# EasyEDA Pro project STM32功能模块V2.epro, board STM32功能模块V2-5V-GND互换
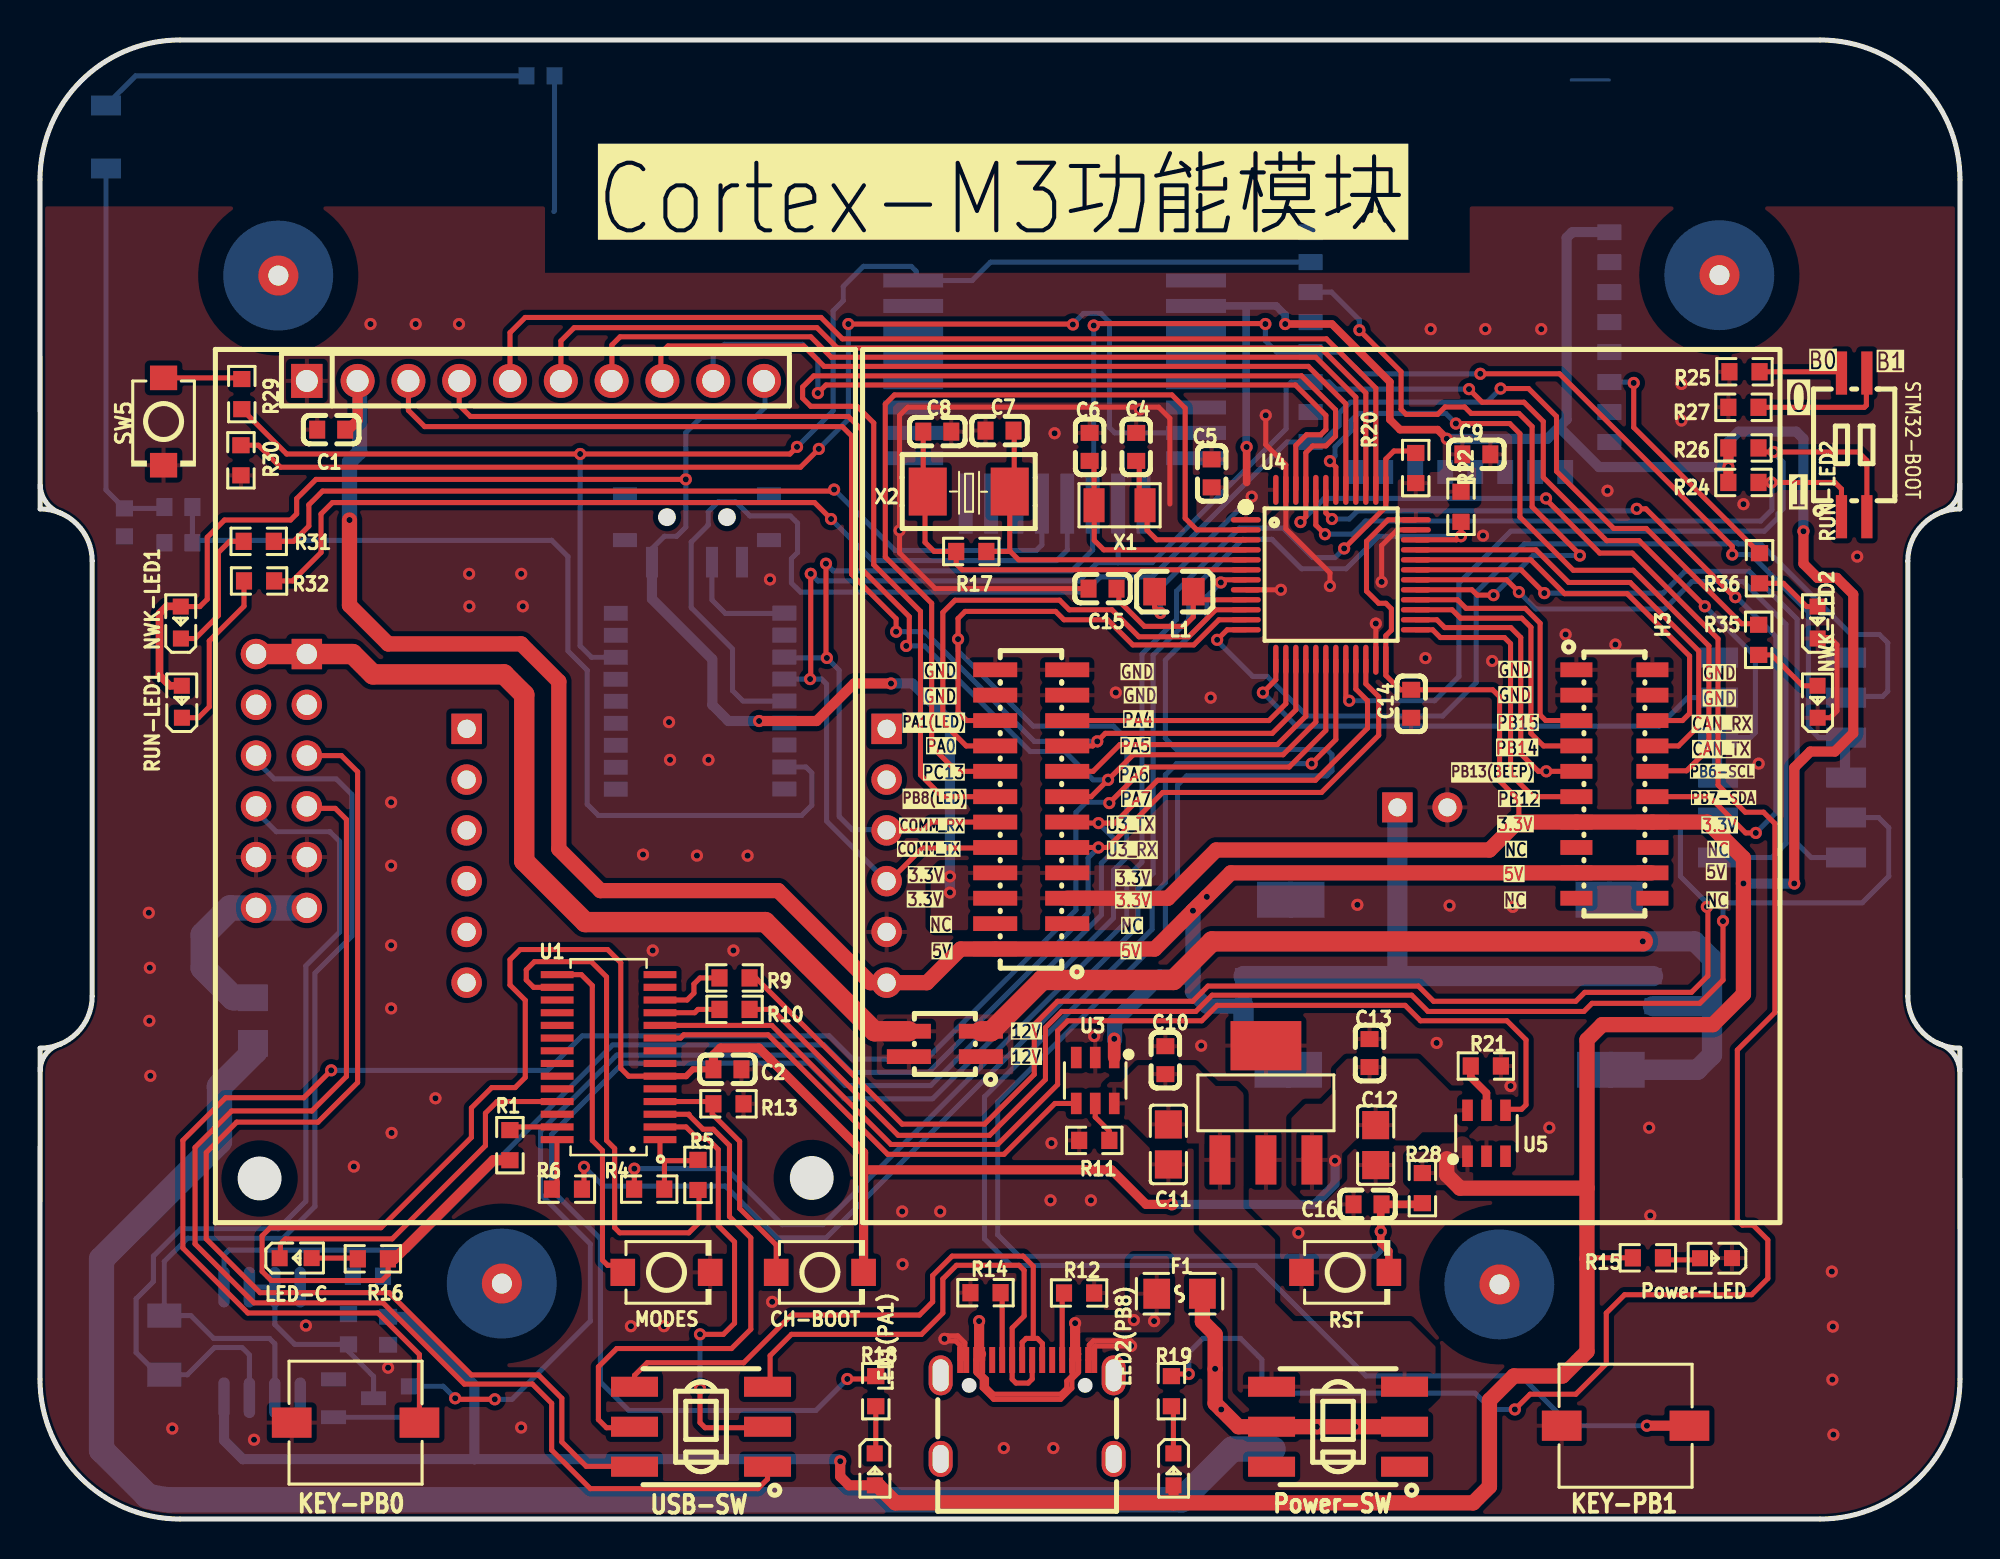
[diagram p1: board, top side]
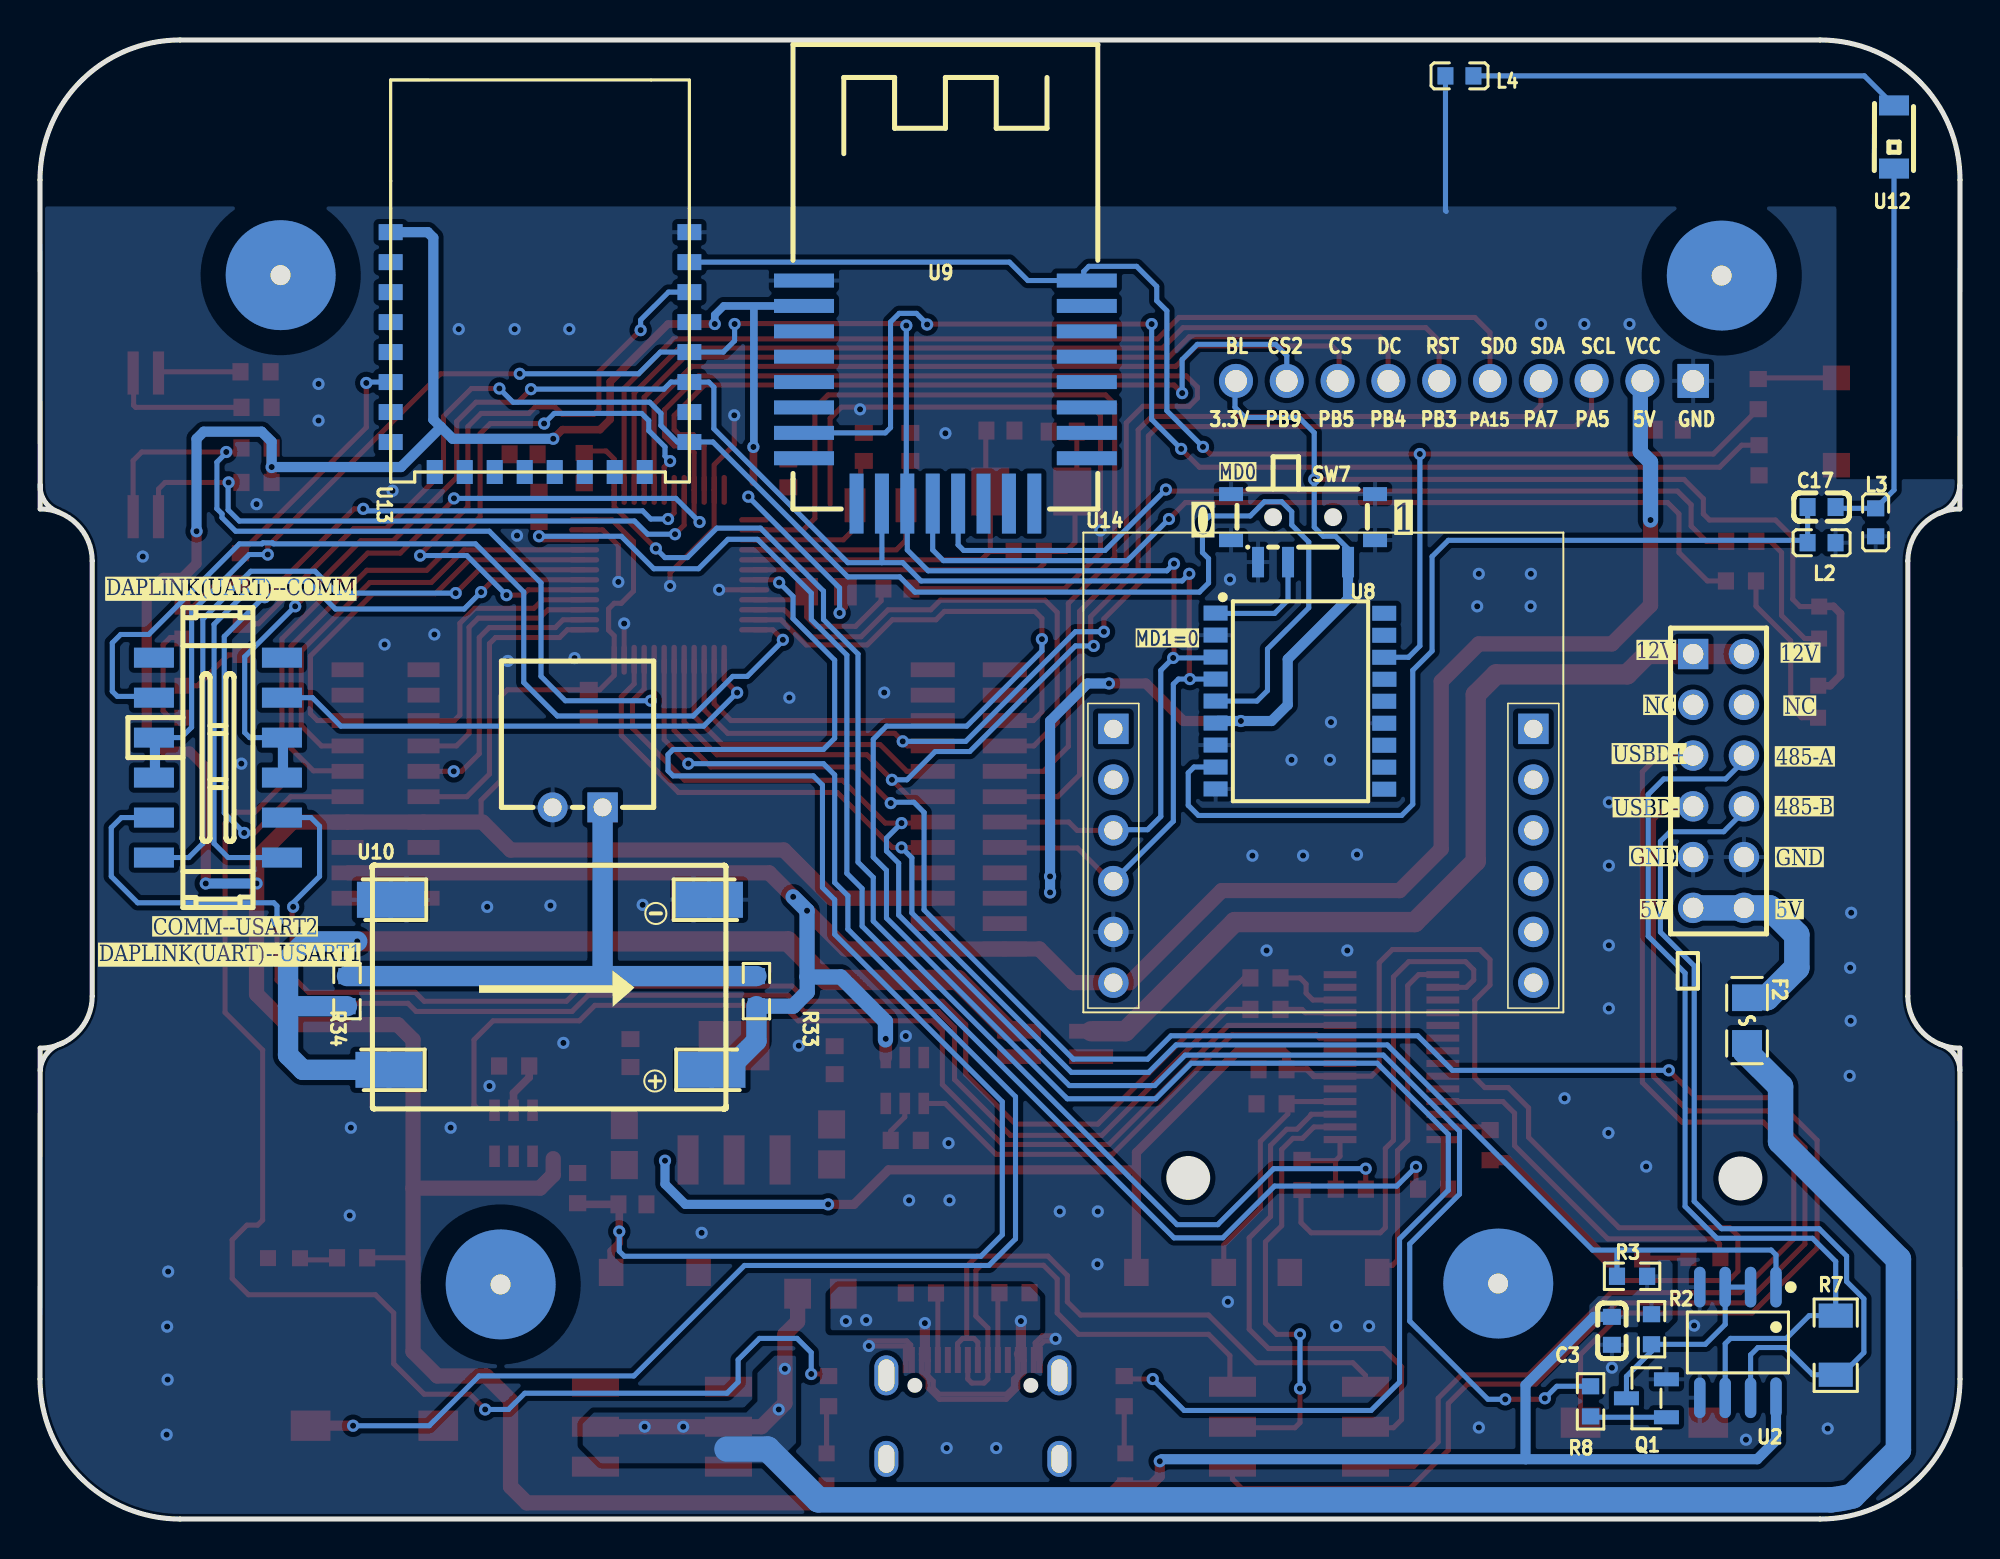
[diagram p2: board, bottom side, seen from below]

Outline 96 x 74 mm; copper layers: Top Layer, Bottom Layer. Coordinates in mm from the lower left corner of the outline.
Outline path: 0.01,22.44 arc(0.3,23.27) 1.03,23.76 ; 1.07,50.31 arc(0.32,50.85) 0.01,51.73 ; 94.87,23.81 arc(95.65,23.3) 95.99,22.44 ; 95.99,51.76 arc(95.76,50.92) 95.07,50.38 ; 0,67 0.01,50.54 arc(1.85,49.77) 2.61,47.94 2.61,26.16 arc(1.85,24.32) 0.01,23.56 0,7 arc(2.05,2.05) 7,0 89,0 arc(93.95,2.05) 96,7 95.99,23.56 arc(94.15,24.32) 93.39,26.16 93.39,47.94 arc(94.15,49.77) 95.99,50.54 96,67 arc(93.95,71.95) 89,74 7,74 arc(2.05,71.95) 0,67
Stack: Top Layer 0.035mm / Dielectric1 1.51mm FR4 er 4.5 / Bottom Layer 0.035mm

## Design rules (mm)
template: JLCPCB Capability(Two Layers Board)
spacing copperThickness1oz (default): track to track 0.102, other pairs 0.152 to 0.3
spacing copperThickness2oz: track to track 0.203, other pairs 0.152 to 0.3
track width copperThickness1oz (default): min 0.127, default 0.254, max 2.54
track width copperThickness2oz: min 0.203, default 0.254, max 2.54
differential pair differentialPair (default): width min 0.127, default 0.254, max 2.54; gap min 0.152, default 0.152
via viaSize (default): diameter min 0.5, default 0.61, max 10; hole min 0.3, default 0.305, max 6.3

## Placement (name value [footprint] x y rotation side)
C1  100nF  [C0603]  14.56 54.5 0 top
C2  100nF  [C0603]  34.37 22.5 180 top
C3  100nF  [C0603]  17.41 9.42 90 bottom
C4  12pF  [C0603]  54.81 53.64 270 top
C5  100nF  [C0603]  58.58 52.31 90 top
C6  12pF  [C0603]  52.48 53.64 270 top
C7  20pF  [C0603]  47.98 54.46 180 top
C8  20pF  [C0603]  44.86 54.41 0 top
C9  100nF  [C0603]  71.82 53.27 0 top
C10  100nF  [C0603]  56.27 22.96 270 top
C11  10uF  [C0805]  56.42 18.74 90 top
C12  10uF  [C0805]  66.78 18.71 90 top
C13  100nF  [C0603]  66.48 23.31 270 top
C14  100nF  [C0603]  68.56 40.79 90 top
C15  100nF  [C0603]  53.13 46.55 0 top
C16  100nF  [C0603]  66.38 15.74 0 top
C17  5pF  [C0603]  6.92 50.63 180 bottom
CH-BOOT  TS-1088-AR02016  [SW-SMD_L3.9-W3.0-P4.45]  38.99 12.34 0 top
CN1  ZX-XH2.54-2PWZ  [CONN-TH_2P-P2.50_ZX-XH2.54-2PWZ]  69.12 35.61 0 bottom
DIP1  -  [贴片铜柱M3*6+1]  11.92 61.96 180 bottom
DIP2  -  [贴片铜柱M3*6+1]  23.09 11.53 180 bottom
DIP3  -  [贴片铜柱M3*6+1]  83.97 61.98 180 bottom
DIP4  -  [贴片铜柱M3*6+1]  72.97 11.48 180 bottom
F1  SMD0805B100TF  [F0805]  56.98 11.27 0 top
F2  SMD0805B100TF  [F0805]  10.65 24.94 270 bottom
H1  HX PZ2.54-2x6P ZZ  [HDR-TH_12P-P2.54-V-M-R2-C6-S2.54_77313-101-12LF]  12.07 36.93 270 bottom
H2  X1321FVS-2x02-C43D48  [HDR-SMD_4P-P1.27-V-F-R2-C2-LS4.8]  45.24 23.77 90 top
H3  X1321FVS-2x10-C43D48  [HDR-SMD_20P-P1.27-V-F-R2-C10-LS4.8]  78.72 36.77 270 top
K1  TS665WS  [SW-SMD_L6.0-W6.0-LS6.6]  15.78 4.82 0 top
K2  TS665WS  [SW-SMD_L6.0-W6.0-LS6.6]  79.28 4.67 0 top
K3  5.1kΩ  [SW-TH_K3-2268S-F1]  87.1 38.1 180 bottom
L1  100uH  [L0805]  56.7 46.4 180 top
L2  39nH  [L0603]  6.92 48.85 0 bottom
L3  39nH  [L0603]  4.22 49.87 90 bottom
L4  68nH  [L0603]  25.03 72.2 180 bottom
LCD1  -  [1.54寸带字库液晶屏]  24.77 45.56 0 top
LED1(PA1)  XL-1608UBC-04  [LED0603-RD_BLUE]  41.74 2.48 270 top
LED2(PB8)  XL-1608UBC-04  [LED0603-RD_BLUE]  56.67 2.48 270 top
LED-C  XL-1608SURC-06  [LED0603-RD_BLUE]  12.78 13.05 0 top
MODES  TS-1088-AR02016  [SW-SMD_L3.9-W3.0-P4.45]  31.32 12.34 0 top
NWK-LED1  XL-1608UBC-04  [LED0603-RD_BLUE]  7.04 44.85 90 top
NWK-LED2  XL-1608UBC-04  [LED0603-RD_BLUE]  88.88 40.89 90 top
Power-LED  XL-1608SURC-06  [LED0603-RD_BLUE]  83.8 13.05 180 top
Q1  S8050  [SOT-23-3_L2.9-W1.3-P1.90-LS2.4-BR]  15.68 6.04 180 bottom
R1  1kΩ  [R0603]  23.5 18.7 90 top
R2  4.7kΩ  [R0603]  15.42 9.49 90 bottom
R3  4.7kΩ  [R0603]  16.4 12.14 0 bottom
R4  100Ω  [R0603]  30.46 16.51 180 top
R5  0Ω  [R0603]  32.9 17.22 90 top
R6  100Ω  [R0603]  26.35 16.51 0 top
R7  120Ω  [R1206]  6.21 8.7 270 bottom
R8  4.7kΩ  [R0603]  18.47 5.89 90 bottom
R9  270Ω  [R0603]  34.73 27.07 0 top
R10  270Ω  [R0603]  34.73 25.5 0 top
R11  150kΩ  [R0603]  52.71 18.94 0 top
R12  5.1kΩ  [R0603]  51.95 11.31 180 top
R13  1kΩ  [R0603]  34.42 20.77 180 top
R14  5.1kΩ  [R0603]  47.27 11.32 180 top
R15  1kΩ  [R0603]  80.39 13.07 180 top
R16  1kΩ  [R0603]  16.64 13.02 0 top
R17  1MΩ  [R0603]  46.56 48.41 0 top
R18  1kΩ  [R0603]  41.79 6.4 270 top
R19  1kΩ  [R0603]  56.57 6.4 270 top
R20  10kΩ  [R0603]  68.79 52.58 270 top
R21  300kΩ  [R0603]  72.29 22.66 180 top
R22  10kΩ  [R0603]  71.05 50.64 90 top
R24  100kΩ  [R0603]  85.17 51.86 0 top
R25  10kΩ  [R0603]  85.22 57.4 180 top
R26  100kΩ  [R0603]  85.17 53.59 0 top
R27  10kΩ  [R0603]  85.17 55.62 180 top
R28  10kΩ  [R0603]  69.12 16.56 90 top
R29  10kΩ  [R0603]  10.09 56.28 90 top
R30  0Ω  [R0603]  10.05 52.97 90 top
R31  1kΩ  [R0603]  10.94 48.92 180 top
R32  1kΩ  [R0603]  10.95 46.93 180 top
R33  0Ω  [R0603]  60.18 26.41 90 bottom
R34  0Ω  [R0603]  80.65 26.41 90 bottom
R35  1kΩ  [R0603]  85.93 43.99 270 top
R36  1kΩ  [R0603]  85.98 47.57 270 top
RST  TS-1088-AR02016  [SW-SMD_L3.9-W3.0-P4.45]  65.26 12.34 0 top
RUN-LED1  XL-1608UBC-04  [LED0603-RD_BLUE]  7.09 40.89 90 top
RUN-LED2  XL-1608UBC-04  [LED0603-RD_BLUE]  88.88 44.85 90 top
SW3  YTSPS-22E58LM  [SW-SMD_6P-L5.8-W5.8-P2.00-LS8.0_YTSPS-22E58LM]  64.9 4.62 180 top
SW4  YTSPS-22E58LM  [SW-SMD_6P-L5.8-W5.8-P2.00-LS8.0_YTSPS-22E58LM]  33.05 4.62 180 top
SW5  TS-1088-AR02016  [SW-SMD_L3.9-W3.0-P4.45]  6.18 54.91 270 top
SW7  MSK12C02-HB  [SW-TH_MSK12C02-HB-1]  32.85 49.58 0 bottom
U1  CH32V203G8R6  [QSOP-28_L9.9-W3.9-P0.64-LS6.0-BL]  28.43 23.11 90 top
U2  SP485EN  [SOP-8_L5.0-W4.0-P1.27-LS6.0-BL]  11.11 8.83 0 bottom
U3  CH217K  [SOT-23-6_L2.9-W1.6-P0.95-LS2.8-BL]  52.76 21.94 180 top
U4  STM32F103C8T6  [LQFP-48_L7.0-W7.0-P0.50-LS9.0-BL]  64.54 47.24 270 top
U5  CH217K  [SOT-23-6_L2.9-W1.6-P0.95-LS2.8-BL]  72.32 19.3 0 top
U6  AIC1221-33GY3TR  [SOT-223_L6.5-W3.5-P2.30-LS7.0-BR]  61.3 20.82 270 top
U7  ZX-1.27BM-2PSMD  [SW-SMD_2P-L5.4-W4.1-P1.27-LS8.4]  90.71 53.74 0 top
U8  -  [Lora小模块]  32.54 41.04 270 bottom
U9  E18-MS1-PCB  [WIRELM-SMD_E18-MS1-PCB]  50.73 56.38 90 bottom
U10  -  [DC-DCmini]  70.03 26.92 180 bottom
U11  X1321FVS-2x12-C43D48  [HDR-SMD_24P-P1.27-V-F-R2-C12-LS4.8]  49.56 35.5 90 top
U12  ANT3216LL00R2400A  [ANT-SMD_L3.2-W1.6]  3.3 69.14 90 bottom
U13  -  [JDY-25M蓝牙模块]  71.1 60.29 90 bottom
U14  -  [度云4G模块]  31.78 37.64 180 bottom
USBC1  TYPE-C-31-M-12  [USB-C_SMD-TYPE-C-31-M-12]  49.36 5.48 0 top
X1  32.768kHz  [CRYSTAL-SMD_L3.2-W1.5-1]  53.98 50.72 0 top
X2  8MHz  [CRYSTAL-SMD_L5.0-W3.2]  46.44 51.41 0 top

## Footprints (pads in the part's own frame, mm; a bottom-side part is the same pattern mirrored in y, then rotated)
1.54寸带字库液晶屏
  rect 1.575x1.7 hole 1.1: 1(-11.43,11.379)
  round 1.7 hole 1.1: 2(-8.89,11.379) 3(-6.35,11.379) 4(-3.81,11.379) 5(-1.27,11.379) 6(1.27,11.379) 7(3.81,11.379) 8(6.35,11.379) 9(8.89,11.379) 10(11.43,11.379)
ANT-SMD_L3.2-W1.6
  rect 1x1.5 smd: 1(-1.578,0) 2(1.578,0)
C0603
  rect 0.8x0.9 smd: 1(-0.7,0) 2(0.7,0)
C0805
  rect 1.41x1.35 smd: 1(-1,0) 2(1,0)
CONN-TH_2P-P2.50_ZX-XH2.54-2PWZ
  rect 1.524x1.5 hole 0.9: 1(-1.25,0)
  round 1.5 hole 0.9: 2(1.25,0)
CRYSTAL-SMD_L3.2-W1.5-1
  rect 1.05x1.7 smd: 1(-1.275,0) 2(1.275,0)
CRYSTAL-SMD_L5.0-W3.2
  rect 1.9x2.4 smd: 1(-2.05,0) 2(2.05,0)
DC-DCmini
  rect 1.8x1.8 smd: 1(-9.296,-4.445) 1(-7.721,-4.445) 2(-9.22,4.064) 2(-7.646,4.064) 3(6.832,-4.445) 3(8.408,-4.445) 4(6.705,4.064) 4(8.28,4.064)
F0805
  rect 1.335x1.5 smd: 1(-1.143,0) 2(1.143,0)
HDR-SMD_4P-P1.27-V-F-R2-C2-LS4.8
  rect 0.74x2.2 smd: 1(-0.635,-1.8) 2(-0.635,1.8) 3(0.635,-1.8) 4(0.635,1.8)
HDR-SMD_20P-P1.27-V-F-R2-C10-LS4.8
  rect 0.74x1.6 smd: 1(-5.715,-1.9) 2(-5.715,1.9) 3(-4.445,-1.9) 4(-4.445,1.9) 5(-3.175,-1.9) 6(-3.175,1.9) 7(-1.905,-1.9) 8(-1.905,1.9) 9(-0.635,-1.9) 10(-0.635,1.9) 11(0.635,-1.9) 12(0.635,1.9) 13(1.905,-1.9) 14(1.905,1.9) 15(3.175,-1.9) 16(3.175,1.9) 17(4.445,-1.9) 18(4.445,1.9) 19(5.715,-1.9) 20(5.715,1.9)
HDR-SMD_24P-P1.27-V-F-R2-C12-LS4.8
  rect 0.74x2.2 smd: 1(-6.985,-1.8) 2(-6.985,1.8) 3(-5.715,-1.8) 4(-5.715,1.8) 5(-4.445,-1.8) 6(-4.445,1.8) 7(-3.175,-1.8) 8(-3.175,1.8) 9(-1.905,-1.8) 10(-1.905,1.8) 11(-0.635,-1.8) 12(-0.635,1.8) 13(0.635,-1.8) 14(0.635,1.8) 15(1.905,-1.8) 16(1.905,1.8) 17(3.175,-1.8) 18(3.175,1.8) 19(4.445,-1.8) 20(4.445,1.8) 21(5.715,-1.8) 22(5.715,1.8) 23(6.985,-1.8) 24(6.985,1.8)
HDR-TH_12P-P2.54-V-M-R2-C6-S2.54_77313-101-12LF
  rect 1.52x1.52 hole 1.02: 1(-6.35,-1.27)
  round 1.52 hole 1.02: 2(-6.35,1.27) 3(-3.81,-1.27) 4(-3.81,1.27) 5(-1.27,-1.27) 6(-1.27,1.27) 7(1.27,-1.27) 8(1.27,1.27) 9(3.81,-1.27) 10(3.81,1.27) 11(6.35,-1.27) 12(6.35,1.27)
JDY-25M蓝牙模块
  rect 0.8x1.2 smd: 1(4.09,7.366) 2(2.59,7.366) 3(1.089,7.366) 4(-0.41,7.366) 5(-1.911,7.366) 6(-3.41,7.366) 7(-4.91,7.366) 8(-6.41,7.366) 17(-6.41,-7.569) 18(-4.91,-7.569) 19(-3.41,-7.569) 20(-1.911,-7.569) 21(-0.41,-7.569) 22(1.089,-7.569) 23(2.59,-7.569) 24(4.09,-7.569)
  rect 1.2x0.8 smd: 9(-7.91,5.164) 10(-7.91,3.664) 11(-7.91,2.164) 12(-7.91,0.664) 13(-7.91,-0.836) 14(-7.91,-2.336) 15(-7.91,-3.836) 16(-7.91,-5.336)
L0603
  rect 0.8x0.864 smd: 1(-0.7,0) 2(0.7,0)
L0805
  rect 1.133x1.377 smd: 1(-0.966,0) 2(0.966,0)
LED0603-RD_BLUE
  rect 0.8x0.8 smd: 1(-0.799,-0.004) 2(0.799,0.004)
Lora小模块
  rect 0.75x1.2 smd: 1(-4.283,-4.676) 2(-3.183,-4.676) 3(-2.083,-4.676) 4(-0.983,-4.676) 5(0.117,-4.676) 6(1.217,-4.676) 7(2.317,-4.676) 8(3.417,-4.676) 9(4.517,-4.676) 10(4.527,3.753) 11(3.427,3.753) 12(2.327,3.753) 13(1.227,3.753) 14(0.127,3.753) 15(-0.973,3.764) 16(-2.073,3.753) 17(-3.173,3.753) 18(-4.273,3.753)
LQFP-48_L7.0-W7.0-P0.50-LS9.0-BL
  oval 0.27x1.5 smd: 1(-2.75,-4.25) 2(-2.25,-4.25) 3(-1.75,-4.25) 4(-1.25,-4.25) 5(-0.75,-4.25) 6(-0.25,-4.25) 7(0.25,-4.25) 8(0.75,-4.25) 9(1.25,-4.25) 10(1.75,-4.25) 11(2.25,-4.25) 12(2.75,-4.25) 25(2.75,4.25) 26(2.25,4.25) 27(1.75,4.25) 28(1.25,4.25) 29(0.75,4.25) 30(0.25,4.25) 31(-0.25,4.25) 32(-0.75,4.25) 33(-1.25,4.25) 34(-1.75,4.25) 35(-2.25,4.25) 36(-2.75,4.25)
  oval 1.5x0.27 smd: 13(4.25,-2.75) 14(4.25,-2.25) 15(4.25,-1.75) 16(4.25,-1.25) 17(4.25,-0.75) 18(4.25,-0.25) 19(4.25,0.25) 20(4.25,0.75) 21(4.25,1.25) 22(4.25,1.75) 23(4.25,2.25) 24(4.25,2.75) 37(-4.25,2.75) 38(-4.25,2.25) 39(-4.25,1.75) 40(-4.25,1.25) 41(-4.25,0.75) 42(-4.25,0.25) 43(-4.25,-0.25) 44(-4.25,-0.75) 45(-4.25,-1.25) 46(-4.25,-1.75) 47(-4.25,-2.25) 48(-4.25,-2.75)
QSOP-28_L9.9-W3.9-P0.64-LS6.0-BL
  rect 0.355x1.64 smd: 1(-4.128,-2.57) 2(-3.493,-2.57) 3(-2.857,-2.57) 4(-2.223,-2.57) 5(-1.587,-2.57) 6(-0.953,-2.57) 7(-0.318,-2.57) 8(0.318,-2.57) 9(0.953,-2.57) 10(1.587,-2.57) 11(2.223,-2.57) 12(2.857,-2.57) 13(3.493,-2.57) 14(4.128,-2.57) 15(4.128,2.57) 16(3.493,2.57) 17(2.857,2.57) 18(2.223,2.57) 19(1.587,2.57) 20(0.953,2.57) 21(0.318,2.57) 22(-0.318,2.57) 23(-0.953,2.57) 24(-1.587,2.57) 25(-2.223,2.57) 26(-2.857,2.57) 27(-3.493,2.57) 28(-4.128,2.57)
R0603
  rect 0.806x0.864 smd: 1(-0.753,0) 2(0.753,0)
R1206
  rect 1.208x1.701 smd: 1(-1.479,0) 2(1.479,0)
SOP-8_L5.0-W4.0-P1.27-LS6.0-BL
  oval 0.574x2.035 smd: 1(-1.905,-2.768) 2(-0.635,-2.768) 3(0.635,-2.768) 4(1.905,-2.768) 5(1.905,2.768) 6(0.635,2.768) 7(-0.635,2.768) 8(-1.905,2.768)
SOT-23-3_L2.9-W1.3-P1.90-LS2.4-BR
  rect 1.25x0.7 smd: 1(1,-0.95) 2(1,0.95) 3(-1,0)
SOT-23-6_L2.9-W1.6-P0.95-LS2.8-BL
  rect 0.532x1.072 smd: 1(-0.95,-1.149) 2(0,-1.149) 3(0.95,-1.149) 4(0.95,1.149) 5(0,1.149) 6(-0.95,1.149)
SOT-223_L6.5-W3.5-P2.30-LS7.0-BR
  rect 2.465x1.05 smd: 1(2.857,-2.3) 2(2.857,0) 3(2.857,2.3)
  rect 2.465x3.54 smd: 4(-2.857,0)
SW-SMD_2P-L5.4-W4.1-P1.27-LS8.4
  rect 0.56x2.158 smd: 1(-0.635,-3.594) 2(0.635,-3.594) 3(0.635,3.594) 4(-0.635,3.594)
SW-SMD_6P-L5.8-W5.8-P2.00-LS8.0_YTSPS-22E58LM
  rect 2.35x1 smd: 1(-3.325,2) 2(-3.325,0) 3(-3.325,-2) 4(3.325,2) 5(3.325,0) 6(3.325,-2)
SW-SMD_L3.9-W3.0-P4.45
  rect 1.23x1.36 smd: 1(-2.185,0) 2(2.185,0)
SW-SMD_L6.0-W6.0-LS6.6
  rect 1.985x1.512 smd: 1(-3.192,0) 2(3.192,0)
SW-TH_K3-2268S-F1
  rect 2x1 smd: 1(3.2,5) 2(3.2,3) 3(3.2,1) 4(3.2,-1) 5(3.2,-3) 6(3.2,-5) 7(-3.2,5) 8(-3.2,3) 9(-3.2,1) 10(-3.2,-1) 11(-3.2,-3) 12(-3.2,-5)
SW-TH_MSK12C02-HB-1
  rect 0.6x1.524 smd: 1(-2.25,1.7) 2(0.75,1.7) 3(2.25,1.7)
  rect 1.2x0.7 smd: 4(-3.6,-1.7) 4(-3.6,0.6) 4(3.6,-1.7) 4(3.6,0.6)
USB-C_SMD-TYPE-C-31-M-12
  oval 1.2x2 hole 0.8x1.6: 0(-4.325,1.706) 1(4.325,1.706)
  oval 1.2x1.8 hole 0.8x1.4: 2(4.325,-2.474) 3(-4.325,-2.474)
  rect 0.3x1.3 smd: A1(-3.35,2.474) A4(-2.55,2.474) A5(-1.25,2.474) A6(-0.25,2.474) A7(0.25,2.474) A8(1.25,2.474) A9(2.55,2.474) A12(3.35,2.474) B1(3.05,2.474) B4(2.25,2.474) B5(1.75,2.474) B6(0.75,2.474) B7(-0.75,2.474) B8(-1.75,2.474) B9(-2.25,2.474) B12(-3.05,2.474)
WIRELM-SMD_E18-MS1-PCB
  rect 0.7x3 smd: 1(5.58,7.07) 2(4.309,7.07) 3(3.039,7.07) 4(1.77,7.07) 5(0.499,7.07) 6(-0.77,7.07) 7(-2.041,7.07) 8(-3.311,7.07) 17(-3.311,-7.07) 18(-2.041,-7.07) 19(-0.77,-7.07) 20(0.499,-7.07) 21(1.77,-7.07) 22(3.039,-7.07) 23(4.309,-7.07) 24(5.58,-7.07)
  rect 3x0.7 smd: 9(-5.58,4.445) 10(-5.58,3.175) 11(-5.58,1.905) 12(-5.58,0.635) 13(-5.58,-0.635) 14(-5.58,-1.905) 15(-5.58,-3.175) 16(-5.58,-4.445)
度云4G模块
  rect 1.524x1.524 hole 0.914: 1(-10.551,1.897) 12(10.449,1.897)
  round 1.524 hole 0.914: 2(-10.551,-0.643) 3(-10.551,-3.183) 4(-10.551,-5.723) 5(-10.551,-8.264) 6(-10.551,-10.803) 7(10.449,-10.803) 8(10.449,-8.264) 9(10.449,-5.723) 10(10.449,-3.183) 11(10.449,-0.643)
贴片铜柱M3*6+1
  round 5.5 smd: 1(0.007,0.254)
  round 2 hole 1x0.9: 2(0,0.254)

## Nets
As in the schematic, except:
3.3V: C3.2 C5.1 C9.1 C14.2 H3.13 H3.14 L1.2 LCD1.10 LED1(PA1).2 LED2(PB8).2 NWK-LED1.2 R2.2 R3.1 R15.2 R20.2 R22.2 R24.1 R26.1 R28.2 RUN-LED1.2 SW7.1 U2.8 U4.1 U4.24 U4.36 U4.48 U5.1 U8.6 U9.2 U11.5 U11.6 U11.7 U11.8 U13.1
3.3VIN: C2.2 C12.2 C13.2 CH-BOOT.2 R1.1 R16.2 U1.6 U5.6 U6.3
GND: C1.1 C2.1 C3.1 C4.1 C5.2 C6.1 C7.2 C8.2 C9.2 C10.1 C11.1 C12.1 C13.1 C14.1 C15.1 C16.1 CN1.2 H1.9 H1.10 H3.1 H3.2 H3.3 H3.4 K1.1 K2.1 L2.1 L3.1 L4.1 LCD1.1 MODES.2 NWK-LED2.1 Power-LED.1 Q1.2 R11.1 R12.1 R13.1 R14.2 R21.1 R25.2 R27.2 R30.1 RST.1 RUN-LED2.1 SW5.2 SW7.3 SW7.4 U1.7 U2.4 U2.5 U3.2 U4.8 U4.23 U4.35 U4.47 U5.2 U6.2 U6.4 U8.2 U8.7 U8.9 U8.13 U9.1 U10.2 U10.4 U11.21 U11.22 U11.23 U11.24 U13.24 U14.5 USBC1.A1 USBC1.A12 USBC1.B1 USBC1.B12
CH_BOOT: CH-BOOT.1 R13.2 U1.4
LED_CON: LED-C.1 U1.25
MODES: MODES.1 U1.15
RST: C16.2 R28.1 RST.2 U4.7
$1N1427: Power-LED.2 R15.1
$1N1431: LED-C.2 R16.1
$1N9049: LED1(PA1).1 R18.2
$1N51325: LED2(PB8).1 R19.2

Pads without a net: DIP1 1 2; DIP2 1 2; DIP3 1 2; DIP4 1 2; H1 3 4; H3 15 16 19 20; K3 1 7; SW3 1 4; U1 5 8 13 14 17 18 19 20 21 22 23 24 26; U3 3; U5 3; U8 10 11 12 14 15 17 18; U9 3 4 5 6 8 9 14 15 16 17 18 19 20 21 22 23; U11 3 4; U13 2 3 4 5 7 8 9 10 11 12 13 14 15 16 18 21; U14 1 2 7 8 9 10 11 12; USBC1 0 1 2 3 A8 B8

## Via types
v1: diameter 0.61, hole 0.305, Top Layer to Bottom Layer, 180 vias

## Routing (per net, layer and track width the routed paths; a pad name or vN(x,y) marks a point on that pad's centre or on a via; arc(x,y) is an arc through that point)
3.3V: length 366.6
  Top Layer w0.254: U4.24 67.29,42.21 68.01,41.49 C14.2 72.64,41.49 72.98,41.14 72.98,36.93 73.95,35.96 73.95,35.1 ; U4.36 67.4,49.99 66.33,48.92 66.33,46.43 66.93,45.82 67.29,45.82 67.57,45.54 67.57,44.47 67.29,44.19 67.29,42.99 ; R15.2 77.39,13.07 77.35,13.03 ; NWK-LED1.2 7.99,45.65 8.36,46.02 8.36,49.12 9.23,49.98 12.53,49.98 12.83,50.29 12.83,51.05 13.8,52.01 v1(32.29,52.01) ; v1(56.02,45.33) 55.73,45.62 55.73,46.4
  Top Layer w0.381: NWK-LED1.2 7.02,45.66 6.33,45.66 5.97,45.31 5.97,42.21 6.5,41.69 RUN-LED1.2 ; v1(70.34,54.05) 69.88,54.5 68,54.5 67.49,55.01 67.49,56.89 64.6,59.79 v1(62.26,59.79) ; v1(60.33,53.64) 60.33,51.86
  Top Layer w0.508: v1(88.17,49.42) 88.17,47.79 88.88,47.09 89.84,47.09 90.66,46.26 90.66,39.32 89.74,38.4 88.52,38.4 87.71,37.59 v1(87.71,31.8) ; LED1(PA1).2 40.45,1.68 40.01,2.13 v1(40.01,2.89) ; R26.1 v1(84.42,52.63) R24.1 ; LED2(PB8).2 56.68,0.81 ; v1(35.95,39.93) 38.83,39.93 40.71,41.8 v1(42.55,41.8)
  Top Layer w0.762: 70.34,18.03 70.34,17.22 71,16.56 77.35,16.56 ; 51.36,31.06 56.39,31.06 58.81,33.47 72.47,33.47 73.87,34.87 H3.13 H3.14 83.37,34.87 85.17,33.07 v1(85.17,31.8) 85.17,26.26 83.65,24.73 78.11,24.73 77.35,23.97 77.35,16.56 ; LED1(PA1).2 41.89,1.68 42.77,0.81 71.66,0.81 72.47,1.62 72.47,5.94 73.69,7.16 76.13,7.16 77.35,8.38 77.35,13.03 77.35,16.56
  Bottom Layer w0.254: SW7.1 30.6,48.55 31.22,49.17 31.83,49.17 32.29,49.63 v1(32.29,52.01) 32.29,54.35 33.05,55.11 35.74,55.11 36.25,55.62 36.25,56.89 LCD1.10 ; v1(56.02,45.33) 56.02,46.59 v1(60.58,51.15)
  Bottom Layer w0.381: v1(62.26,59.79) 62.26,60.24 61.81,60.69 U9.2 ; v1(60.33,53.64) 60.31,53.66 60.31,60.52
  Bottom Layer w0.508: SW7.1 30.6,46.03 33.61,43.02 33.61,40.73 34.42,39.93 v1(35.95,39.93) 37.12,39.93 U8.6 ; 21.72,2.99 39.91,2.99 v1(40.01,2.89) ; 21.72,2.99 10.14,2.99 9.2,3.93 U2.8 ; 21.72,2.99 21.72,6.7 18.31,10.12 17.41,10.12 ; U13.1 76.61,64.38 76.33,64.1 76.33,55.01 75.96,54.64 ; 75.96,54.64 75.96,54.62 77.95,52.63 v1(84.42,52.63) 84.42,53.9 84.92,54.4 87.81,54.4 88.17,54.04 v1(88.17,49.42) ; 75.96,54.64 75.37,54.05 v1(70.34,54.05) ; v1(45.5,31.35) v1(45.5,32.15) 45.5,39.92 43.62,41.8 v1(42.55,41.8) ; v1(85.17,31.8) 85.17,31.8 v1(87.71,31.8)
3.3VIN: length 99
  Top Layer w0.254: 17.4,12.97 17.41,12.96 17.41,12.24 17.1,11.93 11.56,11.93 11.11,12.39 11.11,14.17 11.51,14.57 17.05,14.57 21.57,19.1 21.57,20.57 22.59,21.59 23.75,21.59 24.26,22.09 24.26,25.95 23.5,26.72 23.5,27.99 24.01,28.49 28.38,28.49 29.04,27.83 29.04,22.55 29.43,22.16 U1.6
  Top Layer w0.305: U1.6 32.3,22.16 32.64,22.5 C2.2
  Top Layer w0.457: C2.2 33.67,23.21 34.03,23.57 35.95,23.57 41.18,18.33 41.18,17.47 ; 41.18,17.47 41.18,12.75 ; 41.18,17.47 53.57,17.47 55.3,15.74 v1(56.59,15.74)
  Top Layer w0.508: R1.1 22.66,17.95 17.71,13 17.4,13
  Bottom Layer w0.457: v1(64.75,17.93) 64.75,16.76 63.73,15.74 v1(56.59,15.74)
5V: length 112.8
  Top Layer w0.508: 15.26,54.35 15.88,54.97 LCD1.2
  Top Layer w0.635: U3.1 v1(53.71,24.02)
  Top Layer w0.762: v1(15.47,49.98) 15.47,45.72 17.41,43.78 24.06,43.78 25.94,41.91 25.94,33.52 28.02,31.44 36.91,31.44 41.52,26.83 U14.6 44.35,26.83 46.03,28.52 U11.2 55.73,28.52 v1(57.65,30.43) v1(58.34,31.13) 59.54,32.33 H3.17 80.57,32.33
  Bottom Layer w0.762: 57.64,27.12 55.96,27.12 53.73,24.89 53.73,23.97 ; 57.64,27.12 57.64,26.36 58.34,25.66 R33.1 ; 57.64,27.12 57.65,27.13 v1(57.65,30.43) v1(58.34,31.13) ; LCD1.2 15.98,56.84 15.98,53.39 15.47,52.88 v1(15.47,49.98)
  Bottom Layer w1.016: R33.1 60.18,23.92 U10.3
12V: length 96.7
  Top Layer w1.016: 10.55,43.28 15.63,43.28 16.64,42.26 23.2,42.26 24.21,41.24 24.21,32.91 27.26,29.87 36.27,29.87 41.73,24.4 H2.4 ; H2.3 47.55,24.4 50.12,26.97 56.67,26.97 58.6,28.9 v1(80.14,28.9)
  Bottom Layer w1.016: v1(80.14,28.9) 82.73,28.9 83.6,28.04 83.6,25.66 ; R34.1 83.6,25.66 ; 83.6,25.66 83.6,23.21 82.86,22.47 U10.1
GND: length 74.1
  Top Layer w0.254: USBC1.B12 46.24,8.02 46.24,8.81 45.89,9.17 45.38,9.17 v1(45.22,9.01) ; v1(62.04,46.49) U4.8 ; U4.23 v1(66.79,44.8) ; NWK-LED2.1 89.51,40.09 89.85,40.43 89.85,43.75 89.49,44.1 88.93,44.1 RUN-LED2.1 ; 54.55,8.91 52.67,8.91 52.46,8.71 52.46,8.01 USBC1.B1 ; 45.22,8.91 45.78,8.91 46.01,8.69 USBC1.A1 ; v1(61.29,55.22) 61.29,53.75 62.29,52.75 U4.47 62.29,49.55 64.5,47.34 v1(64.5,46.68) ; v1(67.08,46.89) 67.08,48.71 67.87,49.49 U4.35 ; C15.1 44.76,46.55 42.98,48.34 v1(42.98,49.46) 42.98,55.22 43.39,55.63 55.93,55.63 56.49,55.07 56.49,50.78 ; v1(54.55,8.66) 52.77,8.66 52.71,8.6 USBC1.A12
  Bottom Layer w0.254: 25.69,65.42 25.73,65.46 L4.1
  vias: v1(5.44,30.33) v1(5.47,24.93) v1(5.49,27.58) v1(5.52,22.17) v1(6.61,4.53) v1(10.7,3.97) v1(13.3,9.68) v1(15.69,17.63) v1(16.52,59.79) v1(17.41,7.57) v1(17.56,35.86) v1(17.56,32.69) v1(17.56,28.7) v1(17.56,25.55) v1(17.58,19.32) v1(18.78,59.79) v1(19.77,21.05) v1(20.95,59.79) v1(21.46,47.29) v1(21.47,45.66) v1(24.06,47.29) v1(24.06,4.58) v1(24.14,45.66) v1(29.55,9.65) v1(30.15,33.24) v1(30.64,28.45) v1(31.19,9.65) v1(31.45,39.87) v1(31.5,37.98) v1(32.85,33.19) v1(33.42,37.98) v1(34.67,28.45) v1(35.38,33.19) v1(36.5,47.01) v1(36.61,10.87) v1(43.11,15.39) v1(43.13,12.75) v1(45.01,15.39) v1(48.19,3.55) v1(50.57,18.81) v1(50.53,15.95) v1(50.67,3.55) v1(50.73,54.32) v1(52.55,15.95) v1(52.71,24.16) v1(53.79,41.35) v1(55,55.52) v1(58.06,23.68) v1(58.53,41.09) v1(62.92,14.32) v1(65.87,30.73) v1(69.27,43.07) v1(69.54,59.53) v1(69.83,23.82) v1(70.48,30.69) v1(72.15,49.2) v1(72.27,59.53) v1(72.61,42.93) v1(73.53,21.66) v1(73.64,30.63) v1(75.06,59.53) v1(75.47,19.58) v1(76.28,44.26) v1(78.37,51.45) v1(78.77,43.75) v1(80.46,19.58) v1(80.51,15.19) v1(82.07,56.79) v1(82.07,54.96) v1(85.17,50.78) v1(85.93,37.79) v1(89.59,12.38) v1(89.64,9.63) v1(89.62,6.97) v1(89.67,4.22) v1(90.86,48.15)
VBUS: length 20.2
  Top Layer w0.254: USBC1.B9 47.11,7.22 47.33,7.01 47.33,6.6 47.68,6.24 51.03,6.24 51.34,6.55 51.34,6.9 51.61,7.17 USBC1.B4 ; USBC1.A4 46.81,7.31 47.11,7.01 47.11,6.56 47.68,5.99 51.03,5.99 51.59,6.55 51.59,7 51.91,7.31 USBC1.A9
  Top Layer w0.305: USBC1.B4 51.76,8.11 ; 51.76,8.11 USBC1.A9 ; 51.76,8.11 51.76,8.11 51.76,8.41 51.91,8.26 51.76,8.11 ; USBC1.B9 47.11,8.26 USBC1.A4
  Top Layer w0.508: v1(51.76,9.8) 51.76,8.41 ; 47.05,8.26 46.96,8.35 v1(46.96,9.9)
  vias: v1(54.69,9.95) v1(55.7,9.9)
VDDA: length 9.2
  Top Layer w0.254: 53.83,46.55 53.94,46.44 53.94,45.94 55.22,44.66 57.2,44.66 57.66,45.13 L1.1 58.07,45.99 U4.9
(no net): length 0.2
  Top Layer w0.254: 76.84,31.19 76.97,31.06
485-A: length 47.4
  Bottom Layer w0.254: 10.55,38.2 11.72,37.03 14.81,37.03 15.59,36.25 15.59,29.16 13.75,27.32 13.75,15.64 12.15,14.05 7.38,14.05 6.21,12.88 R7.1 7.54,10.18 8.68,9.04 11.47,9.04 11.74,8.77 U2.6
485-B: length 46.8
  Bottom Layer w0.254: U2.7 10.47,8.21 10.1,8.58 8.73,8.58 7.37,7.22 R7.2 5.91,7.52 5.61,7.52 4.81,8.33 4.81,11.02 5.67,11.88 5.67,13.15 7.04,14.52 11.92,14.52 13.29,15.9 13.29,27.67 14.98,29.36 14.98,33.9 14.49,34.39 11.82,34.39 10.55,35.66
ANT: length 48.5
  Bottom Layer w0.254: U8.8 38.3,37.62 38.59,37.33 38.59,35.71 38.08,35.2 27.92,35.2 27.36,35.76 27.36,42.46 26.4,43.43 26.4,48.15 25.58,48.97 7.74,48.97 L2.2 C17.1
AUX: length 80.8
  Top Layer w0.254: R35.1 85.88,44.79 85.08,44.79 80.31,49.56 78.69,49.56 75.83,52.42 75.83,55.16 74.43,56.56 v1(73.03,56.56)
  Bottom Layer w0.254: v1(73.03,56.56) 72.35,55.88 65.51,55.88 64.95,55.32 64.95,54.71 64.13,53.88 U13.17 62.35,53.88 55.61,47.14 53.02,47.14 52.25,46.38 38.03,46.38 37.57,46.83 37.57,48.05 37.88,48.36 37.88,49.83 37.52,50.19 35.49,50.19 34.78,50.9 33.92,50.9 33.41,50.39 33.41,49.73 32.56,48.88 32.56,45.59 34.63,43.53 34.63,41.45 35.15,40.92 U8.5
BOOT0: length 32.3
  Top Layer w0.254: R24.2 v1(86.57,51.86) 89.74,51.86 90.07,51.53 90.07,50.15 ; U4.44 63.79,49.73 v1(64.25,49.27)
  Bottom Layer w0.254: v1(86.57,51.86) 86.59,51.84 86.59,50.49 86.04,49.93 66.27,49.93 65.61,49.27 v1(64.25,49.27)
BOOT1: length 42.2
  Top Layer w0.254: U4.20 65.29,41.11 v1(65.46,40.94) ; 91.34,50.15 91.34,52.95 90.91,53.39 v1(86.69,53.39) 86.13,53.39 R26.2
  Bottom Layer w0.254: v1(65.46,40.94) 69.73,40.94 70.95,42.16 70.95,46.83 73.54,49.42 86.22,49.42 86.9,50.1 86.9,50.29 87.15,50.55 87.15,52.88 86.69,53.34 v1(86.69,53.39)
CAN_RX: length 20.6
  Top Layer w0.254: U4.32 74.54,47.99 76.23,46.3 79.36,46.3 82.48,43.18 82.48,40.31 82.12,39.95 80.57,39.95
CAN_TX: length 22.8
  Top Layer w0.254: 80.57,38.68 81.92,38.68 82.94,39.69 82.94,43.43 79.51,46.86 76.43,46.86 74.8,48.49 U4.33
CH_BOOT: length 12.1
  Top Layer w0.254: 36.81,12.75 36.81,13.71 34.98,15.54 34.98,18.89 33.61,20.26 33.61,20.71 R13.2 33.55,20.89 U1.4
CH_PA0: length 24.4
  Top Layer w0.254: U1.9 32.02,24.06 32.19,24.23 36.4,24.23 42.39,18.25 48.2,18.25 50.74,20.79 U3.4
CH_PA1: length 55.3
  Top Layer w0.254: U1.10 36.59,24.7 42.55,18.74 47.89,18.74 50.88,21.74 50.88,24.42 51.39,24.93 58.08,24.93 58.86,25.7 68.26,25.7 69.03,24.93 73.35,24.93 74.3,23.97 74.3,20.72 74.08,20.5 73.32,20.5 U5.4
CH_PA5: length 25.6
  Top Layer w0.254: U1.16 24.68,26.6 24.31,26.97 24.31,27.48 24.72,27.88 27.56,27.88 28.33,27.12 28.33,18.94 28.73,18.54 28.73,14.57 28.99,14.32 32.44,14.32 32.95,14.83 32.95,16.21 32.9,16.26 R5.1
COMM_RX: length 100.1
  Top Layer w0.254: v1(39.3,47.8) 39.3,43.12 v1(39.34,43.08) ; v1(84.61,48.26) 84.61,48.66 75.98,57.3 v1(72.02,57.3) ; U14.3 44.14,34.45 44.56,34.87 U11.12 ; v1(52.69,59.71) 52.78,59.81 61.25,59.81 v1(61.27,59.79)
  Bottom Layer w0.254: v1(52.69,59.71) 52.69,50.85 U9.11 52.63,48.48 51.59,47.44 39.65,47.44 v1(39.3,47.8) ; 37.26,43.08 v1(39.34,43.08) 39.96,42.46 39.96,35.15 40.62,34.49 41.84,34.49 ; v1(61.27,59.79) 61.27,58.95 61.83,58.38 U13.20 64.98,58.38 66.07,57.3 v1(72.02,57.3) ; K3.9 88.94,39.1 88.42,39.61 88.42,45.38 85.54,48.26 v1(84.61,48.26)
  Bottom Layer w0.508: 90.25,39.1 90.25,37.25
COMM_TX: length 95.3
  Top Layer w0.254: 42.33,32.03 42.59,32.03 44.13,33.57 47.74,33.57 U11.10 ; v1(83.24,45.66) 79.96,48.95 78.33,48.95 75.16,52.12 75.16,54.91 74.2,55.88 72.11,55.88 v1(71.45,56.53) ; v1(38.54,47.29) 38.54,42.06 v1(38.51,42.02)
  Bottom Layer w0.254: U8.4 v1(38.51,42.02) 39.08,42.02 39.33,41.77 39.33,34.91 U14.4 ; 53.9,47.85 U9.10 ; 53.9,47.85 55.61,47.85 62.31,54.55 62.31,56.63 62.56,56.88 U13.19 64.45,56.88 64.81,56.53 v1(71.45,56.53) ; 53.9,47.85 52.86,47.85 51.95,46.93 38.89,46.93 v1(38.54,47.29) ; v1(83.24,45.66) 85.77,43.14 85.77,39.35 85.51,39.1 K3.3 83.85,39.1
  Bottom Layer w0.508: 83.85,39.1 83.85,37.25
D_SWCLK: length 4.3
  Top Layer w0.254: 31.22,17.93 32.86,17.93 R5.2 ; 31.22,17.93 31,18.15 U1.1 ; 31.22,17.93 31.22,16.51 R4.1
D_SWDIO: length 2.6
  Top Layer w0.254: U1.28 25.85,18.97 25.85,16.76 R6.1
DAP_RX: length 66.2
  Top Layer w0.254: R9.2 35.79,27.07 43.11,19.76 47.22,19.76 49.71,22.25 49.71,24.74 50.88,25.9 57.64,25.9 58.4,26.67 68.92,26.67 69.68,25.9 76.79,25.9 77.24,26.35 82.57,26.35 83.39,27.17 83.39,30.58 v1(83.34,30.63)
  Bottom Layer w0.254: K3.5 82.45,35.1 82.02,34.66 82.02,32.15 83.34,30.83 v1(83.34,30.63)
DAP_TX: length 74.1
  Top Layer w0.254: R10.2 36.61,25.5 42.91,19.2 47.48,19.2 50.27,21.99 50.27,24.59 51.08,25.4 57.79,25.4 58.6,26.21 68.58,26.21 69.4,25.4 77.2,25.4 77.6,25.8 82.99,25.8 84.15,26.96 v1(84.15,29.92)
  Bottom Layer w0.254: v1(84.15,29.92) 84.15,30.67 84.31,30.83 91.12,30.83 92.44,32.15 92.44,34.59 91.93,35.1 K3.11
DAP_USB_D+: length 26.8
  Top Layer w0.254: SW4.5 29.68,4.57 28.33,4.57 27.92,4.97 27.92,7.62 28.83,8.53 34.58,8.53 35.54,9.49 35.54,14.07 34.47,15.13 34.47,18.69 33.66,19.5 33.15,19.5 32.45,20.21 32.45,20.25 U1.3
DAP_USB_D-: length 22.2
  Top Layer w0.254: SW4.2 36.33,4.57 33.25,4.57 33,4.82 v1(33,6.53) ; U1.2 32.3,19.62 32.87,19.05 33.36,19.05 33.92,18.49 33.92,14.68 34.73,13.86 34.73,9.8 34.17,9.24 33.05,9.24
  Bottom Layer w0.254: v1(33,6.53) v1(33,9.24)
LED_CON: length 18.5
  Top Layer w0.254: LED-C.1 12.02,13.09 12.02,13.76 12.27,14.02 17.61,14.02 22.27,18.68 22.27,20.31 22.85,20.89 U1.25
M_USBD+: length 59.4
  Top Layer w0.254: 13.09,38.2 15.07,38.2 15.88,37.38 15.88,21.84 13.9,19.86 9.84,19.86 8.31,18.33 8.31,14.02 11,11.32 17.46,11.32 21.57,7.21 24.92,7.21 26.09,6.04 26.09,3.86 27.31,2.64 29.35,2.64 29.37,2.62 SW4.4
M_USBD-: length 65.1
  Top Layer w0.254: 13.09,35.66 13.19,35.56 14.76,35.56 15.32,35 15.32,22.14 13.59,20.42 9.58,20.42 7.75,18.59 7.75,13.76 10.7,10.82 17.15,10.82 21.22,6.75 24.62,6.75 25.58,5.79 25.58,3.45 27.51,1.52 35.9,1.52 36.38,2 SW4.1
M_VCC: length 10.5
  Bottom Layer w1.27: H1.11 H1.12 9.51,30.58 8.16,29.23 8.16,27.58 9.66,26.08 F2.1
MD0: length 5.8
  Bottom Layer w0.254: SW7.2 33.6,45.98 34.27,45.31 37.2,45.31 U8.1
MODES: length 17.1
  Top Layer w0.254: 29.14,12.7 28.38,12.7 28.12,12.95 28.12,18.44 27.62,18.94 27.62,26.69 27.07,27.24 U1.15
MRST: length 74.4
  Top Layer w0.254: v1(37.85,53.64) 37.49,53.28 v1(27.01,53.28) 12.33,53.28 R29.1
  Bottom Layer w0.254: v1(27.01,53.28) 27.01,53.28 27.01,43.68 27.57,43.11 U8.16 ; 63.53,62.89 47.53,62.89 46.61,61.96 U9.24 43.81,62.12 43.81,62.42 43.56,62.67 41.17,62.67 40.16,61.67 40.16,60.96 39.66,60.45 39.66,55.45 v1(37.85,53.64)
PA0: length 25.3
  Top Layer w0.254: U4.10 58.79,45.49 57.43,44.14 54.95,44.14 53.6,45.49 51.46,45.49 50.98,45.97 45.75,45.97 45.14,45.36 45.14,39.85 46.31,38.68 U11.18
PA1: length 105.1
  Top Layer w0.254: U11.20 46.34,39.95 45.9,40.38 v1(45.9,44.02) 45.9,45.05 46.26,45.41 50.78,45.41 51.2,44.99 53.38,44.99 54.64,43.73 57.69,43.73 58.95,44.99 U4.11 ; R18.1 41.64,7.01 v1(40.37,7.01)
  Bottom Layer w0.254: v1(40.37,7.01) 38.79,5.43 29.44,5.43 28.02,6.85 28.02,14.02 25.58,16.45 25.58,19.25 29.14,22.8 38.44,22.8 40.21,21.03 44.63,21.03 53.68,30.07 53.68,32.46 54.34,33.12 54.34,39.01 53.68,39.67 49.66,39.67 45.9,43.43 v1(45.9,44.02)
PA4: length 13.5
  Top Layer w0.254: 51.36,39.95 61.45,39.95 62.29,40.79 U4.14
PA5: length 61.9
  Top Layer w0.254: U4.15 62.79,40.49 61.61,39.31 53.26,39.31 v1(52.86,38.91) 52.63,38.68 51.36,38.68 ; v1(42.8,44.39) 42.8,45.04 40.58,47.27 40.58,54.19 40.11,54.66 19.23,54.66 18.42,55.47 LCD1.3
  Bottom Layer w0.254: v1(52.86,38.91) 49.71,38.91 44.23,44.39 v1(42.8,44.39)
PA6: length 15.9
  Top Layer w0.254: 51.36,37.41 52.66,37.41 53.99,38.75 61.87,38.75 63.29,40.17 U4.16
PA7: length 63.7
  Top Layer w0.254: U4.17 63.79,39.88 62.15,38.24 54.66,38.24 v1(53.4,36.98) 52.56,36.14 51.36,36.14 ; v1(43.31,43.68) 43.46,43.84 43.46,45.15 41.09,47.52 41.09,54.49 40.42,55.16 21.52,55.16 20.96,55.72 LCD1.4
  Bottom Layer w0.254: v1(43.31,43.68) 44.23,43.68 49.51,38.4 51.24,38.4 52.65,36.98 v1(53.4,36.98)
PA8: length 32.1
  Top Layer w0.254: v1(72.67,46.22) 71.86,46.22 71.59,46.49 U4.29 ; v1(65.97,59.48) 68.05,57.4 68.05,55.52 68.31,55.27 69.88,55.27 70.25,55.64 71.24,55.64 71.56,55.32 73.95,55.32 74.61,54.66 74.61,50.64 76.99,48.26 v1(76.99,48.2)
  Bottom Layer w0.254: U13.22 64.58,61.38 65.97,59.99 v1(65.97,59.48) ; v1(76.99,48.2) 74.66,48.2 v1(72.67,46.22)
PA15: length 52.6
  Top Layer w0.254: U4.38 66.79,56.58 64.32,59.05 40.12,59.05 39.05,60.12 24.26,60.12 23.5,59.36 LCD1.5
PB0: length 95.9
  Top Layer w0.254: U4.18 64.29,39.46 62.46,37.63 55.27,37.63 v1(53.46,35.82) ; K1.2 18.97,8.23 16.9,10.31 10.39,10.31 7.14,13.56 7.14,18.94 9.28,21.08 13.19,21.08 v1(14.56,22.45)
  Bottom Layer w0.254: v1(14.56,22.45) 25.38,22.45 27.11,24.18 39.45,24.18 40.62,23.01 44.33,23.01 51.8,30.48 51.8,35.35 52.3,35.86 53.42,35.86 v1(53.46,35.82)
PB1: length 79.3
  Top Layer w0.254: v1(63.58,37.79) 64.79,39 U4.19
  Top Layer w0.508: K2.2 v1(80.35,4.67)
  Bottom Layer w0.254: v1(63.58,37.79) 56.83,37.79 56.27,37.23 56.27,31.85 55.61,31.19 55.61,29.51 47.22,21.13 47.22,14.02 48.55,12.69 60.78,12.69 66.31,7.16 74.05,7.16 76.54,4.67 v1(80.35,4.67)
PB3: length 48.7
  Top Layer w0.254: LCD1.6 26.05,56.95 26.05,58.94 26.71,59.61 38.85,59.61 39.87,58.59 64.04,58.59 66.29,56.34 U4.39
PB4: length 45.1
  Top Layer w0.254: U4.40 65.79,56.12 63.79,58.13 39.56,58.13 38.54,59.15 29,59.15 28.6,58.74 28.6,56.96 LCD1.7
PB5: length 41.3
  Top Layer w0.254: U4.41 65.29,55.79 63.41,57.67 39.2,57.67 38.18,58.69 31.4,58.69 31.04,58.33 31.04,57.02 LCD1.8
PB6-SCL: length 37.8
  Top Layer w0.254: v1(70.8,54.81) 73.49,54.81 74,54.3 74,50.13 76.66,47.47 79.66,47.47 83.45,43.68 83.45,38.55 82.33,37.43 80.6,37.43 80.57,37.41 ; U4.42 64.79,52.63 v1(64.5,52.93)
  Bottom Layer w0.254: v1(64.5,52.93) 64.75,53.18 64.75,53.64 65.56,54.45 65.56,54.96 65.92,55.32 70.29,55.32 v1(70.8,54.81)
PB7-SDA: length 42.8
  Top Layer w0.254: v1(84.77,46.12) 84.71,46.12 80.3,50.54 v1(79.84,50.54) ; v1(64.6,50.03) 64.29,50.34 U4.43 ; 80.57,36.14 83.47,36.14 85.28,34.33 v1(85.79,34.33)
  Bottom Layer w0.254: v1(84.77,46.12) 84.82,46.12 86.79,44.15 86.79,35.32 v1(85.79,34.33) ; v1(64.6,50.03) 65.46,50.03 65.87,50.44 79.74,50.44 v1(79.84,50.54)
PB8: length 159
  Top Layer w0.254: v1(57.44,7.26) 56.68,7.26 R19.1 ; v1(63.02,49.88) 63.29,50.15 U4.45 63.29,53.35 63.63,53.69 64.3,53.69 64.78,54.17 64.78,55.49 63.07,57.2 38.69,57.2 38.13,56.64 38.13,56.08 38.54,55.67 40.85,55.67 41.69,54.84 41.69,47.75 44.02,45.41 44.02,37.23 45.12,36.14 U11.14 ; v1(75.3,51.06) 75.3,51.01 77.99,48.33 79.61,48.33 83.9,44.04 83.9,36.72 85.26,35.36 86.18,35.36 86.75,34.79 86.75,25.34 84.87,23.46 84.87,14.96 85.12,14.7 85.65,14.7 86.39,13.97 86.39,12.03 85.58,11.22 79.23,11.22 78.31,10.31 78.31,7.77 76.79,6.24 74.5,6.24 v1(73.74,5.48)
  Bottom Layer w0.254: v1(73.74,5.48) 72.57,5.48 71.76,6.29 61.65,6.29 61.09,6.85 61.09,7.97 60.03,9.04 58.15,9.04 57.44,8.33 v1(57.44,7.26) ; v1(63.02,49.88) 64.21,51.06 v1(75.3,51.06)
PB9: length 39.7
  Top Layer w0.254: U4.46 62.79,53.71 63.33,54.25 64.04,54.25 64.29,54.5 64.29,55.21 62.77,56.74 39.3,56.74 v1(38.89,56.33)
  Bottom Layer w0.254: v1(38.89,56.33) 38.89,58.01 38.13,58.77 34.22,58.77 33.66,58.21 33.66,56.94
PB12: length 15.5
  Top Layer w0.254: U4.25 69.63,44.49 70.02,44.1 73.22,44.1 73.53,43.8 73.53,37.27 74.66,36.14 76.97,36.14
PB13: length 14.7
  Top Layer w0.254: U4.26 69.84,44.99 70.23,44.6 73.54,44.6 74.04,44.1 74.04,38.29 74.92,37.41 v1(75.31,37.41) 76.97,37.41
PB14: length 14.1
  Top Layer w0.254: U4.27 70.61,45.49 71.02,45.07 74.09,45.07 74.55,44.61 74.55,39.31 75.18,38.68 76.97,38.68
PB15: length 13.4
  Top Layer w0.254: U4.28 70.87,45.99 71.3,45.56 74.26,45.56 75.01,44.82 75.01,40.23 75.28,39.95 76.97,39.95
PC13: length 46
  Top Layer w0.254: U11.16 45.83,37.41 44.58,38.65 44.58,45.81 42.26,48.13 42.26,55.78 42.72,56.24 56.6,56.24 57.26,55.58 57.26,50.07 57.84,49.49 U4.2
RST: length 80.3
  Top Layer w0.254: U4.7 59.18,46.99 v1(59.04,46.86)
  Top Layer w0.381: RST.2 67.44,13.41 67.04,13.81 v1(67.04,14.39) 67.04,15.7 C16.2 69.06,15.74 R28.1
  Bottom Layer w0.254: v1(59.04,46.86) 58.35,46.16 58.35,45.05 56.27,42.97 56.27,39.06 56.83,38.5 64.34,38.5 64.6,38.25 64.6,37.43 64.34,37.18 57.33,37.18 56.88,36.72 56.88,31.59 56.27,30.98 56.27,29.26 47.89,20.87 47.89,14.22 48.96,13.15 66.78,13.15 67.04,13.4 v1(67.04,14.39)
SWCLK: length 68.3
  Top Layer w0.254: v1(29.72,17.53) 29.72,16.65 29.91,16.45 ; R20.1 68.68,53.44 67.7,53.44 67.29,53.03 U4.37 67.29,50.64 v1(65.21,48.56)
  Bottom Layer w0.254: v1(65.21,48.56) 64.75,48.1 63.63,48.1 62.16,49.58 59.98,49.58 56.83,46.43 56.83,45 55.1,43.28 55.1,32.86 54.34,32.1 54.34,29.92 39.15,14.73 37.11,14.73 34.31,17.53 v1(29.72,17.53)
SWDIO: length 73.5
  Top Layer w0.254: U4.34 70.82,48.99 71.05,49.22 R22.1 ; R6.2 27.2,16.61 v1(27.2,17.62)
  Bottom Layer w0.254: v1(27.2,17.62) 28.16,16.66 34.27,16.66 36.86,14.07 39.3,14.07 54.89,29.66 54.89,31.54 55.66,32.3 55.66,43.23 57.43,45 57.43,46.32 60.13,49.02 61.6,49.02 63.07,47.54 65.31,47.54 66.93,49.17 v1(71.05,49.17)
TYPEC_USB_D+: length 30.5
  Top Layer w0.254: USBC1.A6 49.11,8.84 49.31,9.04 49.64,9.04 ; 49.64,9.04 49.87,9.04 50.12,8.78 50.12,7.97 USBC1.B6 ; 49.64,9.04 49.66,9.06 49.66,12.64 49.15,13.15 45.6,13.15 44.63,12.18 44.63,10.87 43.97,10.21 37.57,10.21 35.18,7.82 30.36,7.82 29.73,7.19 SW4.6
TYPEC_USB_D-: length 25.1
  Top Layer w0.254: USBC1.A7 49.61,7.95 49.61,7.01 49.41,6.8 48.8,6.8 48.61,6.99 USBC1.B7 48.61,9.56 49.21,10.16 49.21,12.44 48.95,12.7 45.82,12.7 45.14,12.01 45.14,10.31 44.08,9.24 37.57,9.24 36.51,8.17 36.51,6.75 SW4.3
UART2_RX: length 3.7
  Top Layer w0.254: R9.1 33,27.07 32.7,26.77 32.7,26.31 32.35,25.97 U1.12
UART2_TX: length 3
  Top Layer w0.254: U1.11 32.73,25.33 32.9,25.5 R10.1
USART1_RX: length 35
  Top Layer w0.254: v1(75.22,46.33) 74.05,47.49 U4.31
  Bottom Layer w0.254: v1(75.22,46.33) 81.16,46.33 82.25,47.42 85.46,47.42 87.86,45.02 87.86,33.8 88.56,33.1 K3.12
USART1_TX: length 35.2
  Top Layer w0.254: v1(73.95,46.38) 73.33,46.99 U4.30
  Bottom Layer w0.254: K3.6 86.59,33.1 87.3,33.8 87.3,44.77 85.16,46.91 82.61,46.91 81.23,45.53 74.79,45.53 v1(73.95,46.38)
USART2_RX: length 26
  Top Layer w0.254: U4.13 61.79,41.99 v1(61.14,41.35)
  Bottom Layer w0.254: K3.2 82.38,41.1 80.96,39.67 62.82,39.67 v1(61.14,41.35)
USART2_TX: length 49.8
  Top Layer w0.254: U4.12 59.36,44.49 v1(58.86,43.99)
  Bottom Layer w0.254: 58.83,43.96 60.64,42.16 61.36,42.16 63.34,40.18 70.14,40.18 71.81,41.85 71.81,46.38 74.22,48.79 84.32,48.79 84.37,48.84 84.86,48.84 84.91,48.79 86.03,48.79 90.56,44.26 91.96,44.26 92.39,43.84 92.39,41.41 92.13,41.16 91.06,41.16 90.94,41.04 90.35,41.04 K3.8
USART3_RX: length 79.8
  Top Layer w0.254: U4.22 66.29,41.79 66.93,41.14 66.93,39.21 64.07,36.35 56.14,36.35 53.38,33.6 v1(52.92,33.6) 51.36,33.6
  Bottom Layer w0.254: R3.2 17.15,13.44 17.13,13.46 ; 17.13,13.46 18.37,13.46 28.63,23.72 39.2,23.72 40.57,22.35 44.43,22.35 52.41,30.32 52.41,33.08 v1(52.92,33.6) ; 17.13,13.46 9.44,13.46 9.2,13.22 U2.1
USART3_TX: length 81.1
  Top Layer w0.254: v1(22.74,5.99) 20.81,5.99 v1(20.76,6.04) ; 51.36,34.87 51.41,34.82 v1(52.92,34.82) 53.74,34.82 55.88,36.96 63.77,36.96 66.38,39.57 66.38,40.94 65.79,41.52 U4.21
  Bottom Layer w0.254: R8.2 20.16,6.64 v1(20.76,6.04) ; v1(52.92,34.82) 53.68,34.07 53.68,33.42 53.07,32.81 53.07,30.22 44.53,21.69 40.27,21.69 38.74,23.21 28.83,23.21 25.03,19.4 25.03,16.25 27.51,13.76 27.51,9.9 23.6,5.99 v1(22.74,5.99)
$1N1427: length 1.9
  Top Layer w0.254: 83,13.05 82.92,12.97 81.15,12.97
$1N1431: length 2.3
  Top Layer w0.254: LED-C.2 15.83,13.05 15.89,13
$1N2016: length 3.4
  Top Layer w0.254: USBC1.A5 48.11,11.24 R14.1
$1N2017: length 3.4
  Top Layer w0.254: USBC1.B5 51.11,11.19 51.2,11.27
$1N2291: length 2.4
  Top Layer w0.254: R1.2 23.65,19.62 U1.27
$1N2650: length 2.1
  Top Layer w0.254: R11.2 53.46,19.41 52.76,20.11 U3.5
$1N2921: length 2.5
  Top Layer w0.381: R21.2 71.54,22.1 72.32,21.31 U5.5
$1N6135: length 8.9
  Top Layer w0.254: U4.3 55.84,48.99 55.35,49.47 55.35,50.62 X1.2 54.96,51.01 54.96,53.11
$1N6137: length 11.8
  Top Layer w0.254: U4.4 53.19,48.49 52.71,48.97 52.71,50.71 X1.1 52.7,52.72 C6.2
$1N6173: length 19.5
  Top Layer w0.254: 48.51,48.41 48.49,48.44 X2.2 48.71,51.63 48.71,54.66 ; 48.51,48.41 R17.2 ; 48.51,48.41 48.93,47.99 U4.5
$1N6209: length 22.9
  Top Layer w0.254: 45.78,48.41 44.71,48.41 44.25,48.87 44.25,51.27 X2.1 44.16,51.63 44.16,54.66 ; U4.6 46.11,47.49 45.81,47.79 R17.1
$1N9049: length 2.4
  Top Layer w0.254: LED1(PA1).1 41.79,3.34 R18.2
$1N10422: length 99.8
  Top Layer w0.762: SW3.2 v1(65.77,4.62) v1(63.84,4.62) SW3.5 59.92,4.62 v1(59.06,5.48) 58.76,5.79 v1(58.76,7.52) 58.76,9.24 58.12,9.88 F1.2
  Bottom Layer w1.27: 61.65,3.5 59.62,3.5 57.08,0.96 6.44,0.96 arc(5.9,1.03) 5.37,1.16 3.08,3.45 3.08,13 8.97,18.89 8.97,21.64 10.75,23.41 10.75,23.8
$1N12578: length 4.1
  Top Layer w0.254: U7.4 90.01,57.4 R25.1
$1N12582: length 7.1
  Top Layer w0.254: U7.3 91.32,57.31 91.32,55.72 91.22,55.62 R27.1
$1N21945: length 10.5
  Bottom Layer w0.254: U2.2 U2.3 11.74,9.74 12.73,8.74 R2.1 15.42,8.39 16.68,7.14 Q1.3
$1N21947: length 3.8
  Bottom Layer w0.254: Q1.1 18.43,5.09 R8.1
$1N25766: length 59.8
  Top Layer w0.254: v1(38.94,53.54) 38.03,52.62 12.02,52.62 10.92,53.72 R30.2 ; v1(51.64,59.76) 51.62,59.79 v1(40.42,59.79)
  Bottom Layer w0.254: v1(40.42,59.79) 40.42,55.02 v1(38.94,53.54) ; v1(51.64,59.76) 51.64,59.79 52.18,60.32 53.04,60.32 53.47,59.89 53.47,54.61 53.74,54.34 U9.7
$1N25771: length 7
  Top Layer w0.254: NWK-LED1.1 7.77,44.05 8.92,45.21 8.92,48.36 9.48,48.92 R31.2
$1N25773: length 8.6
  Top Layer w0.254: RUN-LED1.1 7.92,40.09 8.46,40.64 8.46,43.94 10.2,45.67 R32.2
$1N25774: length 43.5
  Top Layer w0.254: v1(39.7,51.51) 39.63,51.43 14.13,51.43 13.44,50.74 13.44,49.68 12.68,48.92 R31.1
  Bottom Layer w0.254: U9.13 50.09,48.74 49.82,48.46 42.75,48.46 v1(39.7,51.51)
$1N25779: length 46.2
  Top Layer w0.254: R32.1 12.63,46.93 14.05,48.36 14.05,50.29 14.62,50.86 38.73,50.86 v1(39.55,50.03)
  Bottom Layer w0.254: v1(39.55,50.03) 41.63,47.95 50.83,47.95 51.36,48.48 U9.12
$1N25803: length 3.9
  Top Layer w0.254: R29.2 10.03,57.09 SW5.1
$1N27492: length 12.4
  Top Layer w0.254: R36.1 79.69,54.61 v1(79.69,56.84)
  Bottom Layer w0.254: v1(79.69,56.84) 79.64,56.88 U13.6
$1N27806: length 3.6
  Top Layer w0.254: R35.2 86.59,43.23 88.13,41.69 NWK-LED2.2
$1N27810: length 3.4
  Top Layer w0.254: RUN-LED2.2 88.33,45.65 87.17,46.82 R36.2
$1N39568: length 19.5
  Bottom Layer w0.254: 6.22,50.73 6.05,50.57 L3.2 3.3,51.48 U12.1
$1N39802: length 21.5
  Bottom Layer w0.254: U12.2 4.78,72.2 24.19,72.2
$1N51325: length 2.4
  Top Layer w0.254: LED2(PB8).1 56.67,5.54 R19.2
$1N58231: length 28.9
  Bottom Layer w1.016: R33.2 67.87,27.16 ; 67.87,27.16 CN1.1 ; 67.87,27.16 R34.2

## Copper pours and planes (outline as drawn; the poured copper is in the pictures)
3.3V on Top Layer: 68.61,18.38 69.68,18.38 70.08,18.79 71.56,18.79 71.66,18.69 71.66,16.91 71.46,16.71 68.61,16.71 68.41,16.91 68.41,18.18
3.3V on Top Layer: 70.14,54.15 70.14,52.58 69.94,52.38 68.32,52.38 67.89,51.95 67.89,50.05 68.1,49.83 69.58,49.83 70.64,50.85 71.76,50.85 71.81,50.9 71.81,53.97 71.54,54.24 70.23,54.24
3.3V on Top Layer: 45.04,32.71 54.39,32.71 54.79,32.3 54.79,30.02 54.29,29.51 54.18,29.51 54.13,29.46 44.73,29.46 44.53,29.66 44.53,32.2
3.3V on Top Layer: 57.82,51.98 59.74,51.98 60.13,52.37 61.8,52.37 61.96,52.22 61.96,50.8 60.99,49.83 58.23,49.83 57.82,50.24
3.3V on Bottom Layer: 14.54,12.97 15.72,12.97 16.15,12.54 16.15,11.4 16.4,11.15 18.09,11.15 18.53,10.71 18.53,9.9 18.23,9.6 14.79,9.6 14.37,10.01 14.37,12.8
3.3VIN on Top Layer: 62.57,16.76 63.18,16.15 64.19,16.15 65.11,17.06 65.11,18.28 65.77,18.94 68.71,18.94 69.12,19.35 71.25,19.35 71.76,19.86 71.76,20.92 71.25,21.43 70.49,21.43 68.89,23.03 65.35,23.03 64.8,22.49 64.8,21.48 64.09,20.77 63.28,20.77 62.57,20.06
5VIN on Top Layer: 57.94,14.47 59.87,12.54 59.87,6.45 60.53,5.79 69.37,5.79 69.78,6.19 69.78,8.63 68.51,9.9 62.67,9.9 61.75,10.82 61.75,13.99 60.18,15.56 60.18,21.23 60.03,21.38 58.25,21.38 57.94,21.08
5VIN on Top Layer: 53.49,21.87 54.07,21.87 54.9,22.7 57.75,22.7 58.79,21.66 59.81,21.66 60.16,21.31 60.16,16.63 59.7,16.18 58.54,16.18 58.03,16.69 58.03,18.74 57.98,18.79 55.62,18.79 54.42,19.99 53.4,19.99 53.3,20.08 53.3,21.68
12V on Top Layer: 41.84,25.24 48.67,25.24 48.67,22.25 41.84,22.25
GND on Top Layer: -32.3,90.91 110.09,90.91 110.09,-6.78 -32.3,-6.78
GND on Bottom Layer: -26.1,81.87 111.3,81.87 111.3,-5.04 -26.1,-5.04
VBUS on Top Layer: 54.49,10.66 54.03,10.21 51.8,10.21 51.49,9.9 51.49,9.21 51.9,9.21 52.08,9.34 55.91,9.34 56.47,9.9 56.47,13.05 56.37,13.15 54.69,13.15 54.49,12.95
VBUS on Bottom Layer: 46.51,11.63 56.06,11.63 56.47,11.23 56.47,9.45 45.99,9.45 45.99,11.11
$1N10422 on Bottom Layer: 58.2,8.17 59.26,8.17 60.13,7.31 60.13,5.89 60.69,5.33 68.31,5.33 68.86,4.77 68.86,3.7 67.95,2.79 59.21,2.79 58.2,3.81

## Text on the board
Bottom Silkscreen Layer: PA15 | MD0 | MD1=0 | GND | 5V | VCC | SCL | PA5 | SDA | PA7 | SDO | RST | PB3 | DC | PB4 | CS | PB5 | CS2 | PB9 | BL | 3.3V | NC | 12V | 485-A | 485-B | USBD- | USBD+ | COMM--USART2 | DAPLINK(UART)--COMM | DAPLINK(UART)--USART1 | 1 | 0 | ②
Top Silkscreen Layer: COMM_TX | COMM_RX | PA1(LED) | PB8(LED) | PB13(BEEP) | PB6-SCL | PB7-SDA | 3.3V | PC13 | GND | PA0 | NC | 5V | 12V | U3_TX | U3_RX | PA6 | PA5 | PA7 | PA4 | PB14 | PB15 | PB12 | CAN_RX | CAN_TX | STM32-BOOT | B0 | B1 | KEY-PB0 | USB-SW | Power-SW | KEY-PB1 | 0 | 1 | Cortex-M3功能模块
